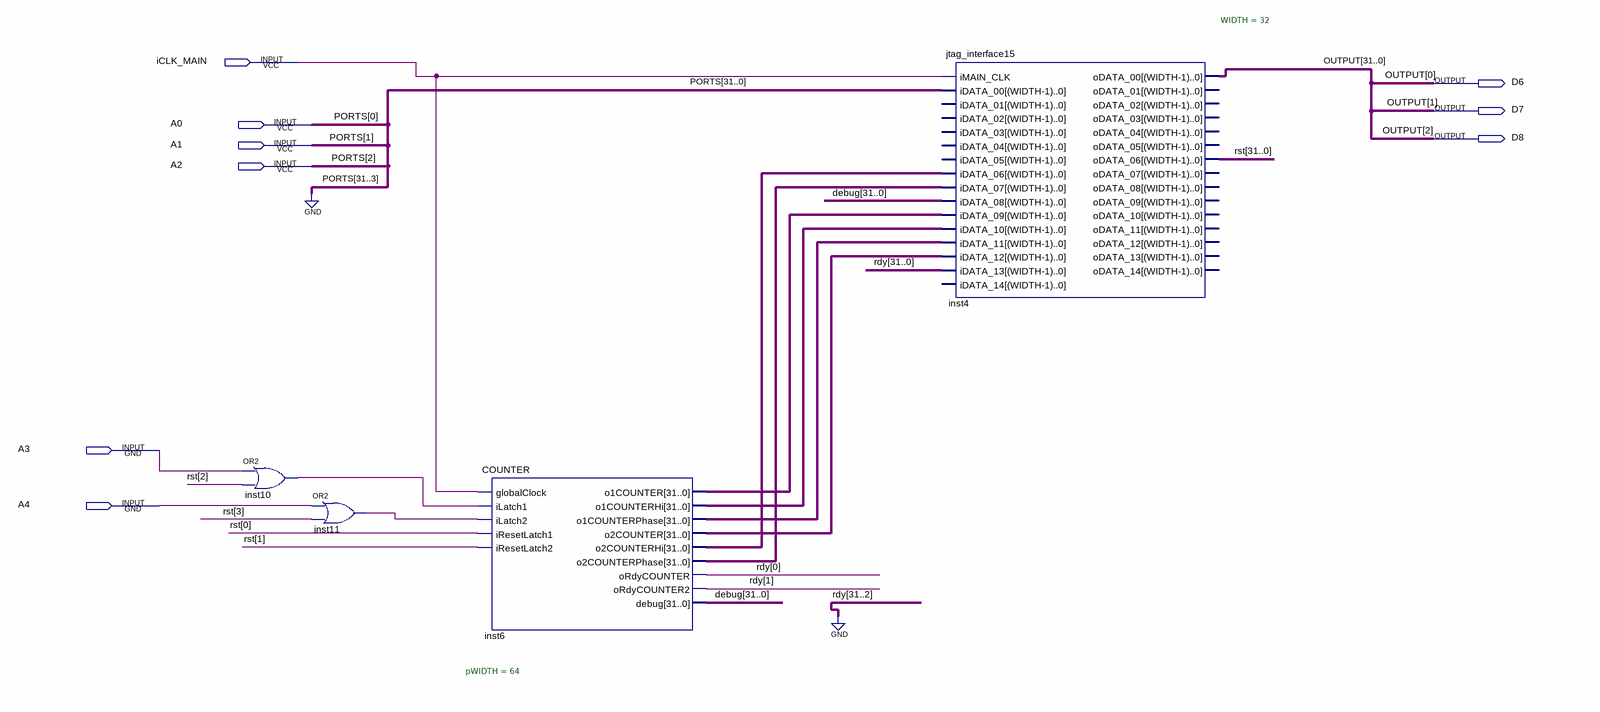
[diagram p0: schematic sheet]
// Quartus schematic MyDesign.bdf as structural Verilog: 4 symbols, 9 pins
module MyDesign (
  input  iCLK_MAIN,
  input  A0,
  input  A1,
  input  A2,
  input  A3,
  input  A4,
  output D6,
  output D7,
  output D8
);

  wire inst10_out, inst11_out;
  wire [1:0] rdy;
  wire [31:0] debug, inst6_o1counter, inst6_o1counterhi, inst6_o1counterphase, inst6_o2counter,
       inst6_o2counterhi, inst6_o2counterphase, rst;
  wire [31:3] OUTPUT;

  or inst10 (inst10_out, A3, rst[2]);
  or inst11 (inst11_out, A4, rst[3]);
  COUNTER #(.pWIDTH(64)) inst6 (
    .globalClock(iCLK_MAIN), .iLatch1(inst10_out), .iLatch2(inst11_out), .iResetLatch1(rst[0]),
    .iResetLatch2(rst[1]), .o1COUNTER(inst6_o1counter), .o1COUNTERHi(inst6_o1counterhi),
    .o1COUNTERPhase(inst6_o1counterphase), .o2COUNTER(inst6_o2counter), .o2COUNTERHi(inst6_o2counterhi),
    .o2COUNTERPhase(inst6_o2counterphase), .oRdyCOUNTER(rdy[0]), .oRdyCOUNTER2(rdy[1]), .debug(debug));
  jtag_interface15 #(.WIDTH(32)) inst4 (
    .iMAIN_CLK(iCLK_MAIN), .iDATA_00({{29{1'b0}}, A2, A1, A0}), .iDATA_06(inst6_o2counterhi),
    .iDATA_07(inst6_o2counterphase), .iDATA_08(debug), .iDATA_09(inst6_o1counter),
    .iDATA_10(inst6_o1counterhi), .iDATA_11(inst6_o1counterphase), .iDATA_12(inst6_o2counter),
    .iDATA_13({{30{1'b0}}, rdy}), .oDATA_00({OUTPUT, D8, D7, D6}), .oDATA_06(rst));  // open: iDATA_01, iDATA_02, iDATA_03, iDATA_04, iDATA_05, iDATA_14, oDATA_01, oDATA_02, oDATA_03, oDATA_04, oDATA_05, oDATA_07, oDATA_08, oDATA_09, oDATA_10, oDATA_11, oDATA_12, oDATA_13, oDATA_14

  // Other names for the same wires on the sheet: OUTPUT[2:0] = {D8, D7, D6}; PORTS[2:0] = {A2, A1, A0}
endmodule
